# Altium project as14120_x31.PrjPCB (part 3 of 3)
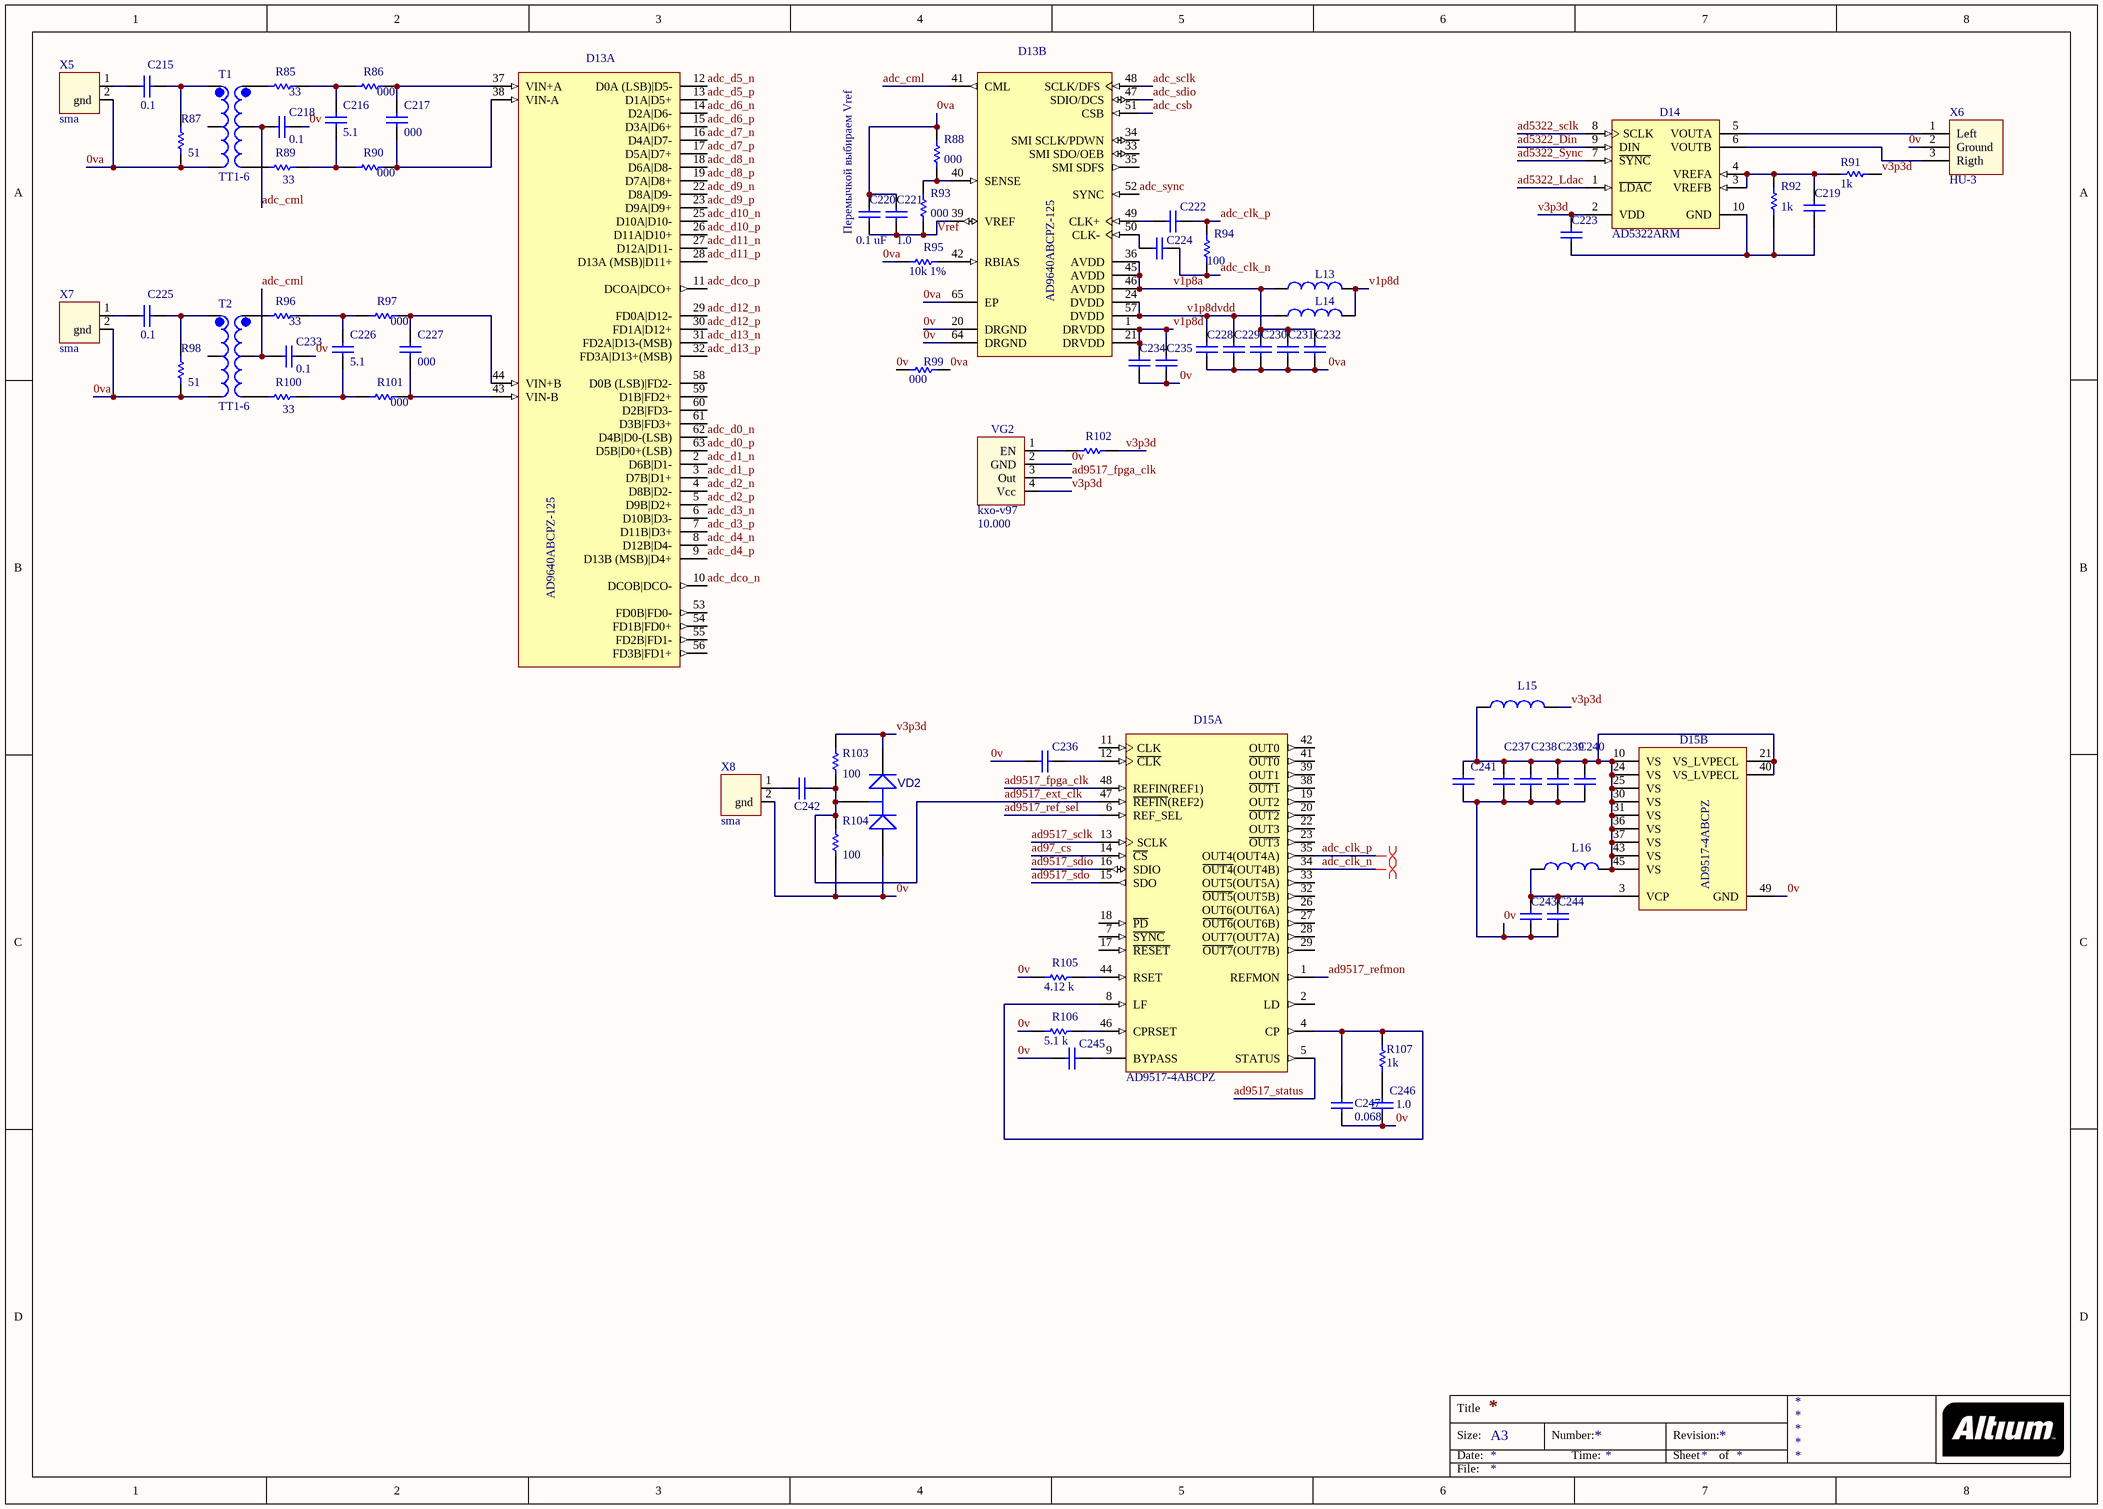
[diagram p8: as14120_x31_adc.SchDoc]

## Nets that join several sheets
0v: as14120_x31_usb (69 pins), as14120_x31_power (63 pins), as14120_x31_fpga_ttl (9 pins), as14120_x31_fpga_power_conf (299 pins), as14120_x31_fpga_ddr (36 pins), as14120_x31_fpga_cypress (D4.P23 R22.2), as14120_x31_adc (26 pins)
ad97_cs: as14120_x31_fpga_cypress (D4.K27), as14120_x31_adc (D15.14)
ad5322_Din: as14120_x31_fpga_cypress (D4.AJ29), as14120_x31_adc (D14.9)
ad5322_Ldac: as14120_x31_fpga_cypress (D4.AG29), as14120_x31_adc (D14.1)
ad5322_sclk: as14120_x31_fpga_cypress (D4.AJ28), as14120_x31_adc (D14.8)
ad5322_Sync: as14120_x31_fpga_cypress (D4.AH29), as14120_x31_adc (D14.7)
ad9517_fpga_clk: as14120_x31_fpga_cypress (D4.P22), as14120_x31_adc (D15.48 VG2.3)
ad9517_ref_sel: as14120_x31_fpga_cypress (D4.K25), as14120_x31_adc (D15.6)
ad9517_refmon: as14120_x31_fpga_cypress (D4.K26), as14120_x31_adc (D15.1)
ad9517_sclk: as14120_x31_fpga_cypress (D4.J27), as14120_x31_adc (D15.13)
ad9517_sdio: as14120_x31_fpga_cypress (D4.L26), as14120_x31_adc (D15.16)
ad9517_sdo: as14120_x31_fpga_cypress (D4.L25), as14120_x31_adc (D15.15)
ad9517_status: as14120_x31_fpga_cypress (D4.J25), as14120_x31_adc (D15.5)
adc_csb: as14120_x31_fpga_cypress (D4.M28), as14120_x31_adc (D13.51)
adc_d0_n: as14120_x31_fpga_cypress (D4.A29), as14120_x31_adc (D13.62)
adc_d0_p: as14120_x31_fpga_cypress (D4.B28), as14120_x31_adc (D13.63)
adc_d1_n: as14120_x31_fpga_cypress (D4.B29), as14120_x31_adc (D13.2)
adc_d1_p: as14120_x31_fpga_cypress (D4.C29), as14120_x31_adc (D13.3)
adc_d2_n: as14120_x31_fpga_cypress (D4.C30), as14120_x31_adc (D13.4)
adc_d2_p: as14120_x31_fpga_cypress (D4.D30), as14120_x31_adc (D13.5)
adc_d3_n: as14120_x31_fpga_cypress (D4.D29), as14120_x31_adc (D13.6)
adc_d3_p: as14120_x31_fpga_cypress (D4.D28), as14120_x31_adc (D13.7)
adc_d4_n: as14120_x31_fpga_cypress (D4.D27), as14120_x31_adc (D13.8)
adc_d4_p: as14120_x31_fpga_cypress (D4.E27), as14120_x31_adc (D13.9)
adc_d5_n: as14120_x31_fpga_cypress (D4.E30), as14120_x31_adc (D13.12)
adc_d5_p: as14120_x31_fpga_cypress (D4.F30), as14120_x31_adc (D13.13)
adc_d6_n: as14120_x31_fpga_cypress (D4.F29), as14120_x31_adc (D13.14)
adc_d6_p: as14120_x31_fpga_cypress (D4.G29), as14120_x31_adc (D13.15)
adc_d7_n: as14120_x31_fpga_cypress (D4.G28), as14120_x31_adc (D13.16)
adc_d7_p: as14120_x31_fpga_cypress (D4.G27), as14120_x31_adc (D13.17)
adc_d8_n: as14120_x31_fpga_cypress (D4.H30), as14120_x31_adc (D13.18)
adc_d8_p: as14120_x31_fpga_cypress (D4.H29), as14120_x31_adc (D13.19)
adc_d9_n: as14120_x31_fpga_cypress (D4.J29), as14120_x31_adc (D13.22)
adc_d9_p: as14120_x31_fpga_cypress (D4.J28), as14120_x31_adc (D13.23)
adc_d10_n: as14120_x31_fpga_cypress (D4.J30), as14120_x31_adc (D13.25)
adc_d10_p: as14120_x31_fpga_cypress (D4.K30), as14120_x31_adc (D13.26)
adc_d11_n: as14120_x31_fpga_cypress (D4.L30), as14120_x31_adc (D13.27)
adc_d11_p: as14120_x31_fpga_cypress (D4.L29), as14120_x31_adc (D13.28)
adc_d12_n: as14120_x31_fpga_cypress (D4.N30), as14120_x31_adc (D13.29)
adc_d12_p: as14120_x31_fpga_cypress (D4.M29), as14120_x31_adc (D13.30)
adc_d13_n: as14120_x31_fpga_cypress (D4.N29), as14120_x31_adc (D13.31)
adc_d13_p: as14120_x31_fpga_cypress (D4.P28), as14120_x31_adc (D13.32)
adc_dco_n: as14120_x31_fpga_cypress (D4.E28), as14120_x31_adc (D13.10)
adc_dco_p: as14120_x31_fpga_cypress (D4.F28), as14120_x31_adc (D13.11)
adc_sclk: as14120_x31_fpga_cypress (D4.K28), as14120_x31_adc (D13.48)
adc_sdio: as14120_x31_fpga_cypress (D4.L28), as14120_x31_adc (D13.47)
adc_sync: as14120_x31_fpga_cypress (D4.M27), as14120_x31_adc (D13.52)
cy_ctrl0: as14120_x31_usb (R70.4), as14120_x31_fpga_cypress (D4.W24)
cy_ctrl1: as14120_x31_usb (R71.1), as14120_x31_fpga_cypress (D4.AC26)
cy_ctrl2: as14120_x31_usb (R71.2), as14120_x31_fpga_cypress (D4.AC27)
cy_ctrl3: as14120_x31_usb (R71.3), as14120_x31_fpga_cypress (D4.Y22)
cy_ctrl4: as14120_x31_usb (R71.4), as14120_x31_fpga_cypress (D4.AA23)
cy_ctrl5: as14120_x31_usb (R73.1), as14120_x31_fpga_cypress (D4.AA24)
cy_ctrl6: as14120_x31_usb (R73.2), as14120_x31_fpga_cypress (D4.AA25)
cy_ctrl7: as14120_x31_usb (R73.3), as14120_x31_fpga_cypress (D4.AE23)
cy_ctrl8: as14120_x31_usb (R73.4), as14120_x31_fpga_cypress (D4.AF24)
cy_ctrl9: as14120_x31_usb (R74.1), as14120_x31_fpga_cypress (D4.AE27)
cy_ctrl10: as14120_x31_usb (R74.2), as14120_x31_fpga_cypress (D4.AD27)
cy_ctrl11: as14120_x31_usb (R74.3), as14120_x31_fpga_cypress (D4.AE25)
cy_ctrl12: as14120_x31_usb (R74.4), as14120_x31_fpga_cypress (D4.AE26)
cy_dq0: as14120_x31_usb (R58.1), as14120_x31_fpga_cypress (D4.U21)
cy_dq1: as14120_x31_usb (R58.2), as14120_x31_fpga_cypress (D4.U22)
cy_dq2: as14120_x31_usb (R58.3), as14120_x31_fpga_cypress (D4.AF29)
cy_dq3: as14120_x31_usb (R58.4), as14120_x31_fpga_cypress (D4.AF30)
cy_dq4: as14120_x31_usb (R63.1), as14120_x31_fpga_cypress (D4.V27)
cy_dq5: as14120_x31_usb (R63.2), as14120_x31_fpga_cypress (D4.W28)
cy_dq6: as14120_x31_usb (R63.3), as14120_x31_fpga_cypress (D4.AE28)
cy_dq7: as14120_x31_usb (R63.4), as14120_x31_fpga_cypress (D4.AD28)
cy_dq8: as14120_x31_usb (R64.1), as14120_x31_fpga_cypress (D4.U27)
cy_dq9: as14120_x31_usb (R64.2), as14120_x31_fpga_cypress (D4.U28)
cy_dq10: as14120_x31_usb (R64.3), as14120_x31_fpga_cypress (D4.AD29)
cy_dq11: as14120_x31_usb (R64.4), as14120_x31_fpga_cypress (D4.AC29)
cy_dq12: as14120_x31_usb (R69.1), as14120_x31_fpga_cypress (D4.AA29)
cy_dq13: as14120_x31_usb (R69.2), as14120_x31_fpga_cypress (D4.AA30)
cy_dq14: as14120_x31_usb (R69.3), as14120_x31_fpga_cypress (D4.AB27)
cy_dq15: as14120_x31_usb (R69.4), as14120_x31_fpga_cypress (D4.AB28)
cy_dq16: as14120_x31_usb (R65.1), as14120_x31_fpga_cypress (D4.U23)
cy_dq17: as14120_x31_usb (R65.2), as14120_x31_fpga_cypress (D4.T24)
cy_dq18: as14120_x31_usb (R65.3), as14120_x31_fpga_cypress (D4.AB29)
cy_dq19: as14120_x31_usb (R65.4), as14120_x31_fpga_cypress (D4.AC30)
cy_dq20: as14120_x31_usb (R66.1), as14120_x31_fpga_cypress (D4.T28)
cy_dq21: as14120_x31_usb (R66.2), as14120_x31_fpga_cypress (D4.T29)
cy_dq22: as14120_x31_usb (R66.3), as14120_x31_fpga_cypress (D4.Y30)
cy_dq23: as14120_x31_usb (R66.4), as14120_x31_fpga_cypress (D4.W30)
cy_dq24: as14120_x31_usb (R67.1), as14120_x31_fpga_cypress (D4.T25)
cy_dq25: as14120_x31_usb (R67.2), as14120_x31_fpga_cypress (D4.R26)
cy_dq26: as14120_x31_usb (R67.3), as14120_x31_fpga_cypress (D4.V29)
cy_dq27: as14120_x31_usb (R67.4), as14120_x31_fpga_cypress (D4.W29)
cy_dq28: as14120_x31_usb (R72.1), as14120_x31_fpga_cypress (D4.T30)
cy_dq29: as14120_x31_usb (R72.2), as14120_x31_fpga_cypress (D4.R30)
cy_dq30: as14120_x31_usb (R72.3), as14120_x31_fpga_cypress (D4.U29)
cy_dq31: as14120_x31_usb (R72.4), as14120_x31_fpga_cypress (D4.V30)
cy_pclk: as14120_x31_usb (R70.1), as14120_x31_fpga_cypress (D4.Y23)
Fpga_CONF_DONE: as14120_x31_usb (D10.D3), as14120_x31_fpga_power_conf (D4.L8 R31.2)
Fpga_Data0: as14120_x31_usb (D10.D5), as14120_x31_fpga_power_conf (D4.AG5)
Fpga_DCLK: as14120_x31_usb (D10.D4), as14120_x31_fpga_power_conf (D4.T7 R32.2)
Fpga_nCONFIG: as14120_x31_usb (D10.C1), as14120_x31_fpga_power_conf (D4.C5 R30.2)
Fpga_nSTATUS: as14120_x31_usb (D10.D2), as14120_x31_fpga_power_conf (D4.K7)
v1p1d: as14120_x31_power (6 pins), as14120_x31_fpga_power_conf (64 pins)
v1p5d: as14120_x31_power (8 pins), as14120_x31_fpga_power_conf (55 pins)
v1p8d: as14120_x31_usb (22 pins), as14120_x31_power (11 pins), as14120_x31_fpga_power_conf (L5.2), as14120_x31_adc (6 pins)
v2p5d: as14120_x31_power (C162.2 C163.2 L8.2 R47.2), as14120_x31_fpga_power_conf (66 pins)
v3p3d: as14120_x31_usb (15 pins), as14120_x31_power (20 pins), as14120_x31_fpga_ttl (D5.8 R34.2 X2.5 X2.7), as14120_x31_adc (8 pins)